# Altium schematic sheet Headphone.SchDoc: Board Level Annotation
size 431 x 279 mm; Organization: Altium Limited; Address1: L3, 12a Rodborough Rd; Address2: Frenchs Forest; Address3: NSW; Address4: Australia 2086; DocumentNumber: 3; SheetNumber: 3; SheetTotal: 8
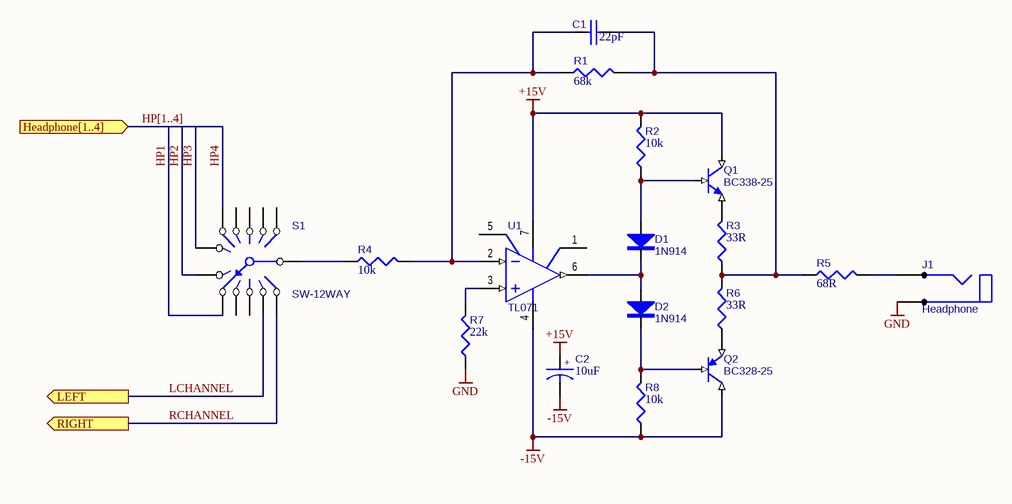
[diagram p0: Headphone.SchDoc]

## Parts
C1  22pF  [RAD0.2]
C2  10uF  [RB.2/.4]
D1  1N914  [DIODE0.4]
D2  1N914  [DIODE0.4]
J1  Headphone  [JACK-6.25MM]
Q1  BC338-25  [TO-92A]
Q2  BC328-25  [TO-92A]
R1  68k  [AXIAL0.4]
R2  10k  [AXIAL0.4]
R3  33R  [AXIAL0.4]
R4  10k  [AXIAL0.4]
R5  68R  [AXIAL0.4]
R6  33R  [AXIAL0.4]
R7  22k  [AXIAL0.4]
R8  10k  [AXIAL0.4]
S1  SW-12WAY  [SW-12WAY]
U1  TL071  [DIP8]

## Ports
Headphone[1..4] (in), LEFT (out), RIGHT (out)

## Nets
+15V: C2.1 Q1.1(C) R2.2 U1.7(VCC+)
-15V: C2.2 Q2.1(C) R8.1 U1.4(VCC-)
GND: J1.3(C) R7.1
HP1: S1.8
HP2: S1.7
HP3: S1.6
HP4: S1.5
LCHANNEL: S1.11 ; port LEFT
RCHANNEL: S1.12 ; port RIGHT
NetC1_1: C1.1 R1.1 R4.2 U1.2(IN-)
NetC1_2: C1.2 R1.2 R3.1 R5.1 R6.2
NetD1_1: D1.1(A) Q1.2(B) R2.1
NetD1_2: D1.2(K) D2.1(A) U1.6(OUT)
NetD2_2: D2.2(K) Q2.2(B) R8.2
NetJ1_1: J1.1(A) R5.2
NetQ1_3: Q1.3(E) R3.2
NetQ2_3: Q2.3(E) R6.1
NetR4_1: R4.1 S1.13
NetR7_2: R7.2 U1.3(IN+)

Not connected (* = marked no-connect by the designer): S1 1 2 3 4 9 10; U1 1(N1/O.S.) 5(O.S._N2)

## Buses and harness runs
bus HP[1..4] = port Headphone[1..4]

## Notes on the sheet
- 8
- 7
- 6
- 5
- 4
- 3
- DWG. NO.
- REV.
- SHT.
- 2
- 1
- THIS DOCUMENT AND THE DATA DISCLOSED HEREIN OR HEREWITH IS THE PROPERTY OF ALTIUM LIMITED AND MAY BE FREELY DISTRIBUTED IN WHOLE. NO RIGHTS ARE RESERVED OR EXPRESS OR IMPLIED WARANTEE GIVEN.
- REVISION
- DESCRIPTION
- DATE
- APPROVED
- F
- E
- D
- C
- B
- A
- TITLE
- SCALE:
- SIZE
- CAGE CODE
- FILE NAME
- DWG NO.
- SHEET
- OF
- REV
- (in symbol CAPACITOR POL) +

## Library data of the parts
C1 = CAP: Capacitor
C2 = CAPACITOR POL: Bi-Polar Capacitor; Value: 10uF
D1 D2 = 1N914: Diode
J1 = PHONEJACK MONO
Q1 = BC338-25: NPN BJT
Q2 = BC328-25: PNP BJT
R1-R8 = RES1: Resistor
  R1: Value: 68k
  R2 R4 R8: Value: 10k
  R3 R6: Value: 33R
  R5: Value: 68R
  R7: Value: 22k
U1 = TL071: Low-Noise  JFET-Input Operational Amplifiers